# EAGLE design stompadapter 10-17-20 (EAGLE 9.6.2)
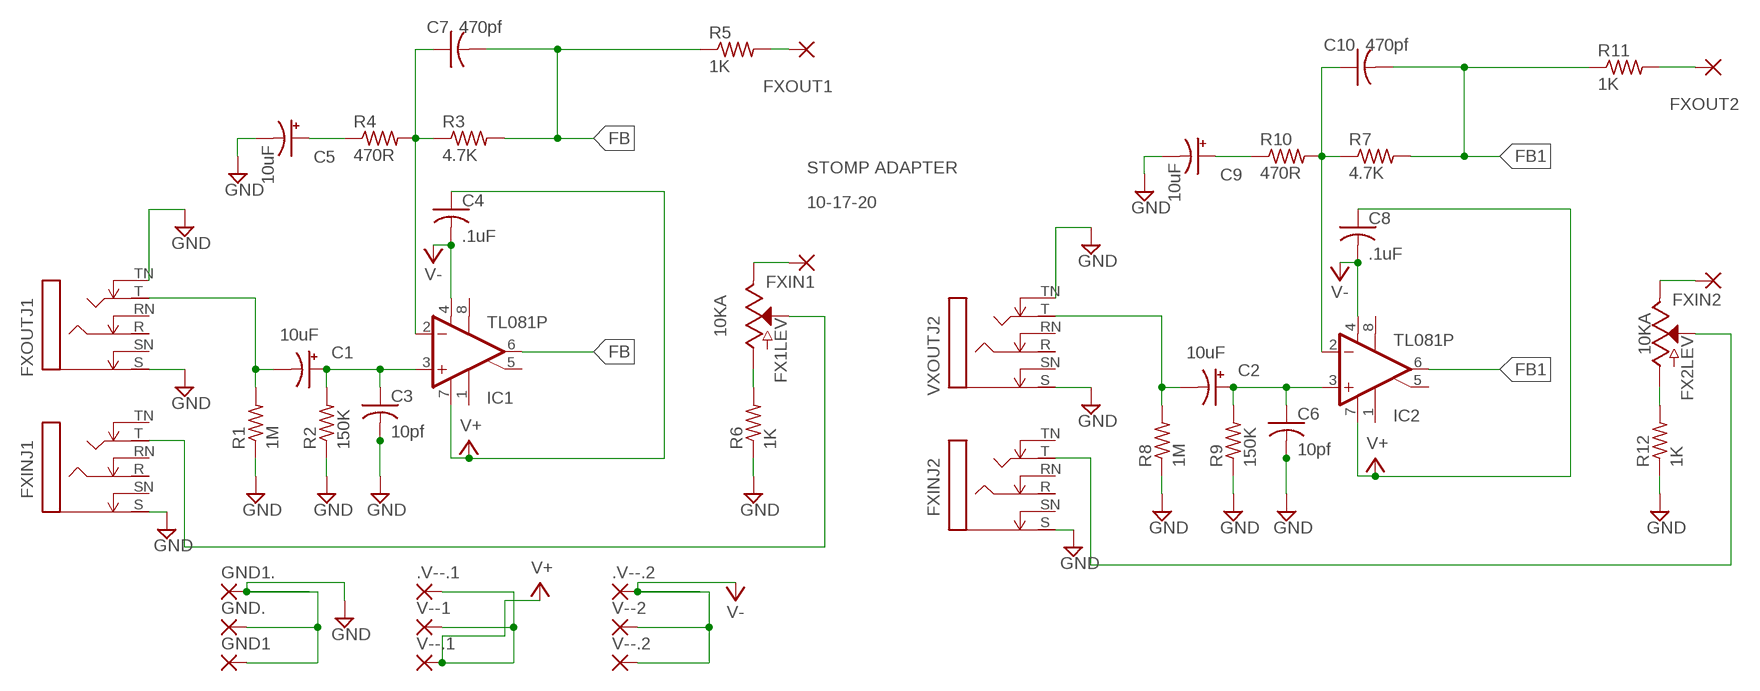
[diagram p0: schematic, sheet 1]

## Parts
.V--.1  3,17/1,3  [3,17/1,3]
.V--.2  3,17/1,3  [3,17/1,3]
C1  10uF  CPOL-USE5-6  [E5-6]
C2  10uF  CPOL-USE5-6  [E5-6]
C3  10pf  C-US050-025X075  [C050-025X075]
C4  .1uF  C-US025-025X050  [C025-025X050]
C5  10uF  CPOL-USE5-6  [E5-6]
C6  10pf  C-US050-025X075  [C050-025X075]
C7  470pf  C-US050-025X075  [C050-025X075]
C8  .1uF  C-US025-025X050  [C025-025X050]
C9  10uF  CPOL-USE5-6  [E5-6]
C10  470pf  C-US050-025X075  [C050-025X075]
FX1LEV  10KA  POTENTIOMETER-PTH-9MM-1/20W-20%-KIT  [POT-PTH-ALPS-KIT]
FX2LEV  10KA  POTENTIOMETER-PTH-9MM-1/20W-20%-KIT  [POT-PTH-ALPS-KIT]
FXIN1  3,17/1,3  [3,17/1,3]
FXIN2  3,17/1,3  [3,17/1,3]
FXINJ1  NEUTRIXNMJ6HCD2  [NMJ6HCD2-LARGEPINS]
FXINJ2  NEUTRIXNMJ6HCD2  [NMJ6HCD2-LARGEPINS]
FXOUT1  3,17/1,3  [3,17/1,3]
FXOUT2  3,17/1,3  [3,17/1,3]
FXOUTJ1  NEUTRIXNMJ6HCD2  [NMJ6HCD2-LARGEPINS]
GND1  3,17/1,3  [3,17/1,3]
GND1.  3,17/1,3  [3,17/1,3]
GND.  3,17/1,3  [3,17/1,3]
IC1  TL081P  [DIL08]
IC2  TL081P  [DIL08]
R1  1M  R-US_0204/7  [0204/7]
R2  150K  R-US_0204/7  [0204/7]
R3  4.7K  R-US_0204/7  [0204/7]
R4  470R  R-US_0204/7  [0204/7]
R5  1K  R-US_0204/7  [0204/7]
R6  1K  R-US_0204/7  [0204/7]
R7  4.7K  R-US_0204/7  [0204/7]
R8  1M  R-US_0204/7  [0204/7]
R9  150K  R-US_0204/7  [0204/7]
R10  470R  R-US_0204/7  [0204/7]
R11  1K  R-US_0204/7  [0204/7]
R12  1K  R-US_0204/7  [0204/7]
V--1  3,17/1,3  [3,17/1,3]
V--2  3,17/1,3  [3,17/1,3]
V--.1  3,17/1,3  [3,17/1,3]
V--.2  3,17/1,3  [3,17/1,3]
VXOUTJ2  NEUTRIXNMJ6HCD2  [NMJ6HCD2-LARGEPINS]

## Nets
FB: C7.2 IC1.6(OUT) R3.2 R5.1
FB1: C10.2 IC2.6(OUT) R7.2 R11.1
GND: C3.2 C5.- C6.2 C9.- FXINJ1.S FXINJ2.S FXOUTJ1.S FXOUTJ1.TN GND1.1(P) GND1..1(P) GND..1(P) R1.1 R2.1 R6.1 R8.1 R9.1 R12.1 VXOUTJ2.S VXOUTJ2.TN
N$1: C1.+ C3.1 IC1.3(+IN) R2.2
N$2: C1.- FXOUTJ1.T R1.2
N$3: FXOUT1.1(P) R5.2
N$4: C5.+ R4.1
N$5: C7.1 IC1.2(-IN) R3.1 R4.2
N$6: FX1LEV.P$1(E) FXIN1.1(P)
N$7: FX1LEV.P$3(A) R6.2
N$8: FX1LEV.P$2(S) FXINJ1.T
N$9: C2.+ C6.1 IC2.3(+IN) R9.2
N$10: C2.- R8.2 VXOUTJ2.T
N$11: FXOUT2.1(P) R11.2
N$12: C9.+ R10.1
N$13: C10.1 IC2.2(-IN) R7.1 R10.2
N$14: FX2LEV.P$1(E) FXIN2.1(P)
N$15: FX2LEV.P$3(A) R12.2
N$16: FX2LEV.P$2(S) FXINJ2.T
V+: .V--.1.1(P) C4.1 C8.1 IC1.7(V+) IC2.7(V+) V--1.1(P) V--.1.1(P)
V-: .V--.2.1(P) C4.2 C8.2 IC1.4(V-) IC2.4(V-) V--2.1(P) V--.2.1(P)
Unconnected: FXINJ1.R FXINJ1.RN FXINJ1.SN FXINJ1.TN FXINJ2.R FXINJ2.RN FXINJ2.SN FXINJ2.TN FXOUTJ1.R FXOUTJ1.RN FXOUTJ1.SN IC1.1(ON1) IC1.5(ON2) IC1.8(OPT) IC2.1(ON1) IC2.5(ON2) IC2.8(OPT) VXOUTJ2.R VXOUTJ2.RN VXOUTJ2.SN

## Notes on the sheet
- STOMP ADAPTER
- 10-17-20

## Library data of the parts
.V--.1 .V--.2 GND1 GND1. GND. V--1 V--2 V--.1 V--.2 = wirepad-NONAMES:3,17/1,3: THROUGH-HOLE PAD
C1 C2 C5 C9 = adafruit:CPOL-US: POLARIZED CAPACITOR, American symbol
C3 C4 C6-C8 C10 = adafruit:C-US: CAPACITOR, American symbol
FX1LEV FX2LEV = SparkFun-Resistors:POTENTIOMETER: Potentiometer (Pot) Three-terminal potentiometers, with an adjustable wiper and two adjustable resistors. A pot can be used to create a configurable voltage divider, or as a variable resistor. Variants ALPS_POT and ALPS_POT_KIT - PTH, breadboard compatible, 9mm square pots Rotary Potentiometer - Linear (10k ohm) <https://www.sparkfun.com/products/9288> (COM-09288) The KIT variant exposes copper on only one side of the PTH pad, so the part can only be assembled on one side of the PCB. Useful for beginner soldering kits.; PROD_ID: RES-09177; SF_SKU: COM-09288; VALUE: 10k
FXIN1 FXIN2 FXOUT1 FXOUT2 = wirepad:3,17/1,3: THROUGH-HOLE PAD
FXINJ1 FXINJ2 FXOUTJ1 VXOUTJ2 = jacks:NEUTRIXNMJ6HCD2
IC1 IC2 = linear:TL081: OP AMP
R1-R12 = rcl:R-US_: RESISTOR, American symbol

## Board
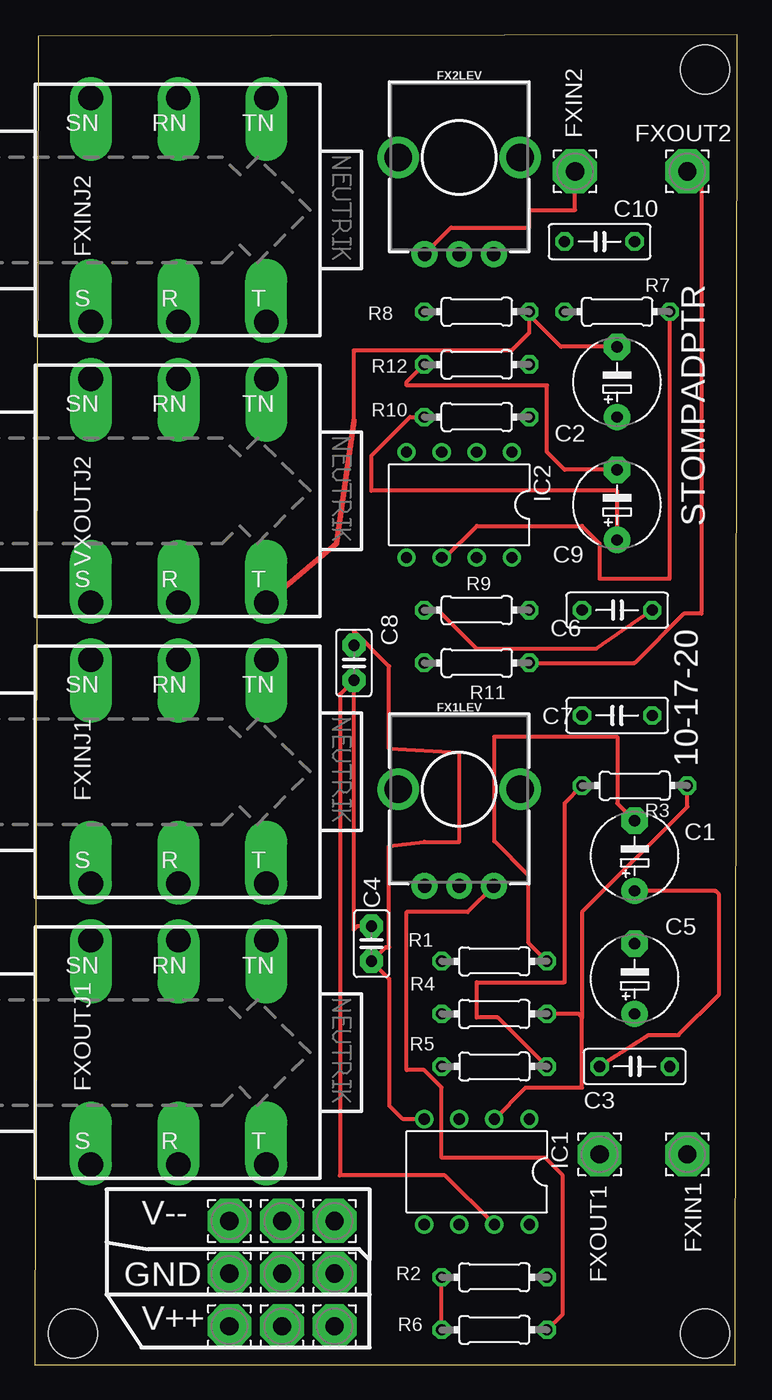
[diagram p1: board, top side]
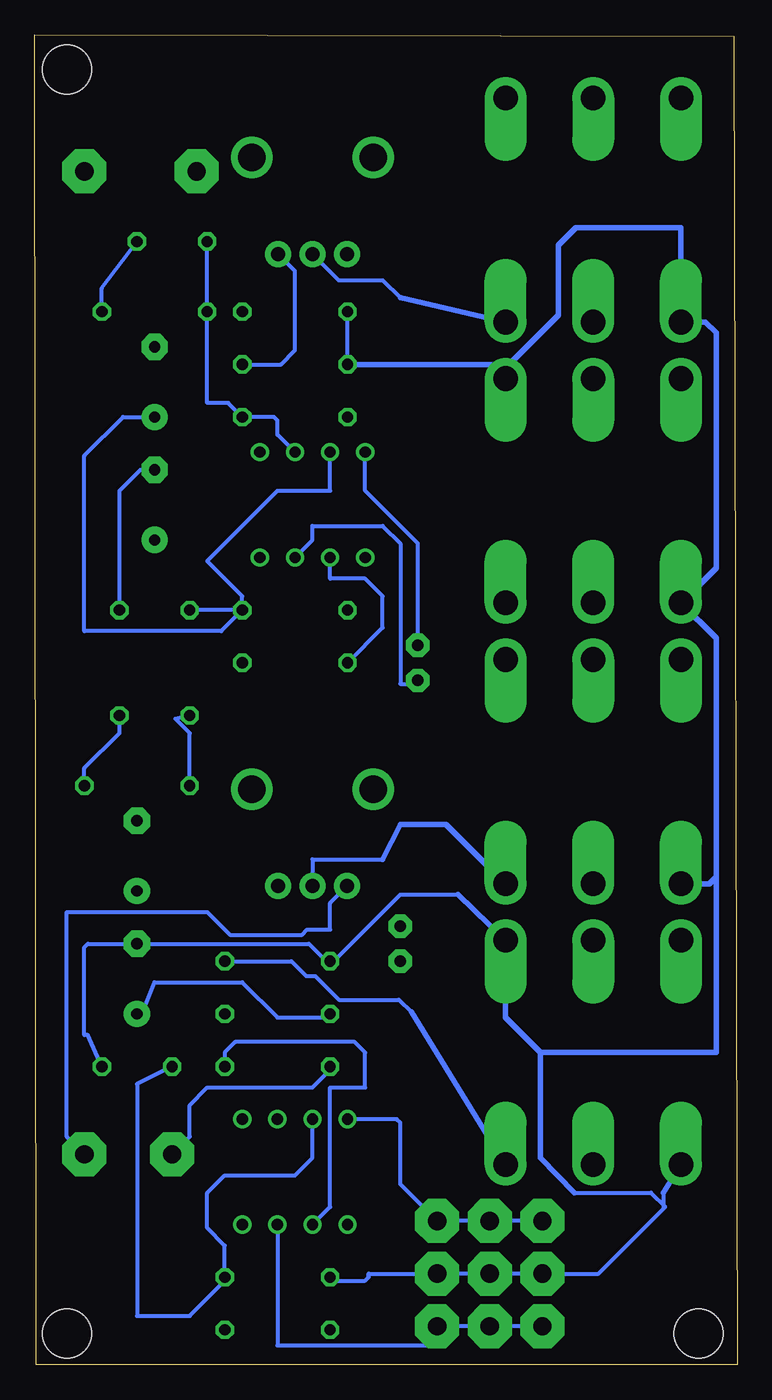
[diagram p2: board, bottom side, seen from below]

Size 50.85 x 96.26 mm. Coordinates in mm from the lower left corner, seen from the top.
Outline: 0,0 50.72,0 50.85,96.26 0.25,96.13 0,0
Copper layers (1*16): Top 0.035mm / dielectric 1.5mm / Bottom 0.035mm
Design rules "default": minimum track width 6mil, minimum drill 0.35mm, track to track 6mil, track to pad 6mil, pad to pad 6mil, via to via 6mil, smd to smd 6mil, copper to edge 40mil, drill to drill 6mil, minimum pad ring 10mil, minimum via ring 8mil, stop-mask expansion 4mil, vias tented up to drill 0mil, thermal gap 10mil
Holes 3.56 mm at 48.51,93.73 48.51,2.29 2.79,2.29

### Footprints (pad centres in the part's own frame; a part is rotated, then mirrored left to right if it is on the bottom)
3,17/1,3 = drill 1.321 pad 3.175 octagon: 1 0,0
E5-6 = drill 0.813 pad 1.905: + -2.54,0 | drill 0.813 pad 1.905 octagon: - 2.54,0
C050-025X075 = drill 0.813 octagon: 1 -2.54,0; 2 2.54,0
C025-025X050 = drill 0.813 pad 1.676 octagon: 1 -1.27,0; 2 1.27,0
POT-PTH-ALPS-KIT = drill 1 pad 1.88: P$1 7,-2.5; P$2 7,0; P$3 7,2.5 | drill 2: P$4 0,-4.4; P$5 0,4.4
NMJ6HCD2-LARGEPINS = drill 1.778 pad 3.048 offset: R 0,8.115; RN 0,-8.115; S 6.35,8.115; SN 6.35,-8.115; T -6.35,8.115; TN -6.35,-8.115
DIL08 = drill 0.813 pad 1.27: 1 -3.81,-3.81; 2 -1.27,-3.81; 3 1.27,-3.81; 4 3.81,-3.81; 5 3.81,3.81; 6 1.27,3.81; 7 -1.27,3.81; 8 -3.81,3.81
0204/7 = drill 0.813 octagon: 1 -3.81,0; 2 3.81,0

### Placement (x,y rotation side)
.V--.1  21.72,2.79 0 top
.V--.2  17.91,10.41 0 top
C1  43.43,36.83 90 top
C2  42.16,71.12 90 top
C3  43.43,21.59 0 top
C4  24.38,30.48 270 top
C5  43.43,27.94 90 top
C6  42.16,54.61 0 top
C7  42.16,46.99 180 top
C8  23.11,50.8 90 top
C9  42.16,62.23 90 top
C10  40.89,81.28 0 top
FX1LEV  30.73,41.66 270 top
FX2LEV  30.73,87.38 270 top
FXIN1  47.24,15.24 0 top
FXIN2  39.12,86.36 0 top
FXINJ1  10.41,42.93 180 top
FXINJ2  10.41,83.57 180 top
FXOUT1  40.89,15.24 0 top
FXOUT2  47.24,86.36 0 top
FXOUTJ1  10.41,22.61 180 top
GND1  14.1,6.6 0 top
GND1.  17.91,6.6 0 top
GND.  21.72,6.6 0 top
IC1  32,13.97 180 top
IC2  30.73,62.23 180 top
R1  33.27,29.21 0 top
R2  33.27,6.35 0 top
R3  43.43,41.91 180 top
R4  33.27,25.4 0 top
R5  33.27,21.59 180 top
R6  33.27,2.54 0 top
R7  42.16,76.2 0 top
R8  32,76.2 0 top
R9  32,54.61 0 top
R10  32,68.58 0 top
R11  32,50.8 0 top
R12  32,72.39 0 top
V--1  17.91,2.79 0 top
V--2  21.72,10.41 0 top
V--.1  14.1,2.79 0 top
V--.2  14.1,10.41 0 top
VXOUTJ2  10.41,63.25 180 top

### Tracks (layer width: path | path; a pad name or v marks a point on that pad's centre or on a via)
FB
  Top 0.305: R5.1 33.53,25.15 32,25.15 32,27.69 38.35,27.69 38.35,40.64 R3.2
  Bottom 0.305: C7.2 40.64,46.74 39.62,45.72 R3.2 | IC1.6 29.46,11.43 29.46,20.07 26.92,20.07 26.92,22.61 27.69,23.37 36.32,23.37 37.08,22.61 R5.1
FB1
  Top 0.305: R7.2 45.97,56.9 40.89,56.9 40.89,59.44 39.62,60.71 32,60.71 29.72,58.42 IC2.6
  Bottom 0.305: R7.2 45.97,77.89 C10.2 | R11.1 25.65,53.34 25.65,55.63 26.92,56.9 29.46,56.9 IC2.6
GND
  Top 0.305: C9.- 38.35,64.77 37.08,66.04 37.08,70.87 26.92,70.87 26.92,71.12 R12.1 | C6.2 40.64,51.82 32,51.82 29.21,54.61 R9.1 | R6.1 R2.1
  Bottom 0.305: R12.1 R8.1 | C6.2 44.7,55.88 44.7,63.25 43.18,64.77 C9.- | 5.33,12.45 5.33,11.3 | 5.33,11.3 10.03,6.6 GND1.1 GND1..1 GND..1 26.67,6.6 26.67,6.35 26.92,6.1 29.21,6.1 R2.1 | 5.33,11.3 5.21,11.43 6.24,12.46 11.78,12.46 | 20.21,34.04 24.38,34.04 29.21,29.21 R1.1 29.72,29.21 30.99,30.48 C5.- 46.99,30.48 47.24,30.23 47.24,23.88 46.99,23.88 C3.2
  Bottom 0.406: R12.1 17.79,72.39 VXOUTJ2.TN 16.76,72.14 12.95,75.95 12.95,81.03 11.68,82.3 4.06,82.3 FXINJ2.S 2.3,75.45 1.52,74.68 1.52,57.67 VXOUTJ2.S 1.52,52.59 1.52,35.31 | 1.52,35.31 2.02,34.81 FXINJ1.S | 14.22,22.61 1.52,22.61 1.52,35.31 | 14.22,22.61 16.76,25.15 FXOUTJ1.TN 20.21,34.04 | 11.78,12.46 14.22,14.99 14.22,22.61 | FXOUTJ1.S 5.33,12.45
N$1
  Top 0.305: C3.1 44.45,23.88 46.61,23.88 49.56,26.82 49.56,34.04 49.3,34.29 C1.+
  Bottom 0.305: IC1.3 30.73,14.99 32,13.72 37.08,13.72 38.35,12.45 38.35,9.91 37.08,8.64 R2.2 37.08,6.1 39.62,3.56 43.43,3.56 43.43,20.32 C3.1
N$2
  Top 0.305: R1.2 35.75,30.54 35.75,35.43 33.27,37.9 33.27,45.47 42.16,45.47 42.16,40.64 C1.-
  Bottom 0.305: R1.2 32.26,29.21 31.19,28.14 30.55,28.14 28.82,26.42 24.48,26.42 23.59,25.53
  Bottom 0.406: 23.59,25.53 FXOUTJ1.T
N$3
  Bottom 0.305: FXOUT1.1 39.62,16.51 39.62,18.8 38.35,20.07 30.73,20.07 29.46,21.34 R5.2
N$4
  Bottom 0.305: R4.1 29.46,25.15 33.27,25.15 35.81,27.69 42.16,27.69 43.18,25.15 C5.+
N$5
  Top 0.305: IC1.2 35.56,20.07 39.62,20.07 39.62,25.15 | 39.62,25.15 39.37,25.4 R4.2 | R3.1 47.24,40.39 39.62,32.77 39.62,25.15
  Bottom 0.305: R3.1 47.24,43.18 44.7,45.72 C7.1
N$6
  Bottom 0.305: FXIN1.1 48.51,16.51 48.51,32.77 38.35,32.77 36.71,31.12 31.49,31.12 31.12,31.5 29.46,31.5 29.46,33.43 FX1LEV.P$1
N$7
  Top 0.305: R6.2 38.23,3.68 38.23,13.72 36.96,14.99 29.46,14.99 29.46,20.07 28.19,21.34 26.92,21.34 26.92,32.77 31.34,32.77 FX1LEV.P$3
N$8
  Bottom 0.305: 25.65,36.58 30.73,36.58 FX1LEV.P$2
  Bottom 0.406: FXINJ1.T 21.07,39.12 24.38,39.12 25.65,36.58
N$9
  Bottom 0.305: R9.2 C6.1 | R9.2 35.81,55.63 38.35,58.17 33.27,63.25 29.46,63.25 IC2.3 | R9.2 37.34,53.09 47.24,53.09 47.24,65.79 44.45,68.58 C2.+
N$10
  Top 0.305: 23.11,68.33 23.11,73.41 34.54,73.41 35.81,74.68 35.81,75.95 | 35.81,75.95 R8.2 | C2.- 38.1,73.66 35.81,75.95
  Top 0.406: 23.11,68.33 21.84,59.44 VXOUTJ2.T
N$11
  Top 0.305: R11.2 43.43,50.8 46.99,54.36 48.29,54.36 48.29,85.32 FXOUT2.1
N$12
  Top 0.305: C9.+ 42.16,63.25 24.38,63.25 24.38,65.79 27.18,68.58 R10.1
N$13
  Bottom 0.305: C10.1 R7.1 38.35,69.6 36.83,69.6 R10.2 33.53,68.58 33.27,68.33 33.27,67.31 IC2.2
N$14
  Top 0.305: FX2LEV.P$1 30.15,82.3 35.81,82.3 35.81,83.57 39.12,83.57 FXIN2.1
N$15
  Bottom 0.305: R12.2 33.02,72.39 32,73.41 32,79.15 FX2LEV.P$3
N$16
  Bottom 0.305: 24.38,77.22 25.65,78.49 28.84,78.49 FX2LEV.P$2
  Bottom 0.406: 24.38,77.22 FXINJ2.T
V+
  Top 0.305: C4.1 23.37,31.75 23.11,31.5 C8.1 22.1,48.51 22.1,13.72 29.72,13.72 IC1.7
  Bottom 0.305: IC2.7 30.73,59.69 30.73,60.71 25.65,60.71 24.38,59.44 24.38,49.28 23.37,49.28 C8.1 | V--.1.1 V--1.1 .V--.1.1 21.72,1.42 33.27,1.42 IC1.7
V-
  Top 0.305: IC1.4 26.67,17.78 25.65,18.8 25.65,27.94 C4.2 25.4,30.23 25.65,30.23 25.65,37.54 28.19,37.85 30.73,37.85 30.73,44.27 25.65,44.58 25.65,50.55 23.11,53.09 C8.2
  Bottom 0.305: C8.2 23.11,59.44 26.92,63.25 IC2.4 | V--.2.1 .V--.2.1 V--2.1 24.38,13.08 24.38,17.53 24.64,17.78 IC1.4

### Text on the board
tNames: STOMPADPTR | 10-17-20 | V-- | GND | V++